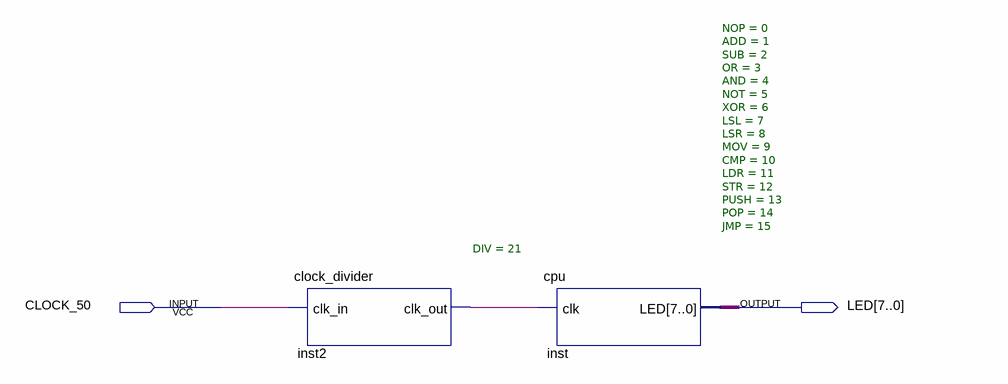
[diagram p0: schematic sheet]
// Quartus schematic mycpu.bdf as structural Verilog: 2 symbols, 2 pins
module mycpu (
  input  CLOCK_50,
  output [7:0] LED
);

  wire inst2_clk_out;

  clock_divider #(.DIV(21)) inst2 (.clk_in(CLOCK_50), .clk_out(inst2_clk_out));
  cpu #(.NOP(0), .ADD(1), .SUB(2), .OR(3), .AND(4), .NOT(5), .XOR(6), .LSL(7), .LSR(8), .MOV(9), .CMP(10), .LDR(11), .STR(12), .PUSH(13), .POP(14), .JMP(15)) inst (
    .clk(inst2_clk_out), .LED(LED));
endmodule
